# Altium schematic sheet X32258MOB4SI.schdoc
size 127 x 101 mm
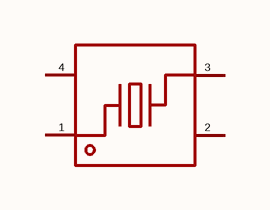
[diagram p0: X32258MOB4SI.schdoc]

## Parts
X?  x32258mob4si  [CRYSTAL-SMD_4P-L3.2-W2.5-BL]  (value not drawn)

## Nets

Not connected (* = marked no-connect by the designer): X? 1 2(GND) 3 4(GND)

## Library data of the parts
X? = x32258mob4si: 晶振类型:贴片晶振;频率:8MHz;常温频差:±10ppm;负载电容:12pF;频率稳定度:±20ppm;; Manufacturer: YXC(扬兴晶振); AddInBom: yes; ModelId: ff2dfd5650294453a14147960efe1838; ModelTransform: 125.984,98.425,0,0,0,0,0,0,0; Value: 8MHz; Normal temperature Frequency Tolerance: ±10ppm; Load Capacitance: 12pF; Frequency Stability: ±20ppm; Equivalent Series Resistance(ESR): 180Ω; Symbol: X32258MOB4SI; LCSC Part Name: YSX321SL 8MHZ 4P 3225 12PF ±10PPM -40~85℃ (±20PPM); SupplierPart: C2682775; ManufacturerPart: X32258MOB4SI; Supplier Footprint: SMD3225-4P; JLCPCB Part Class: Extended Part; Datasheet: https://item.szlcsc.com/datasheet/X32258MOB4SI/2777872.html; Supplier: LCSC; ConvertToPcb: yes; FootprintName: CRYSTAL-SMD_4P-L3.2-W2.5-BL; ModelName: CRYSTAL-SMD_4P-L3.2-W2.5-BL; Type: 贴片晶振; Operating Temperature: -40℃~+85℃